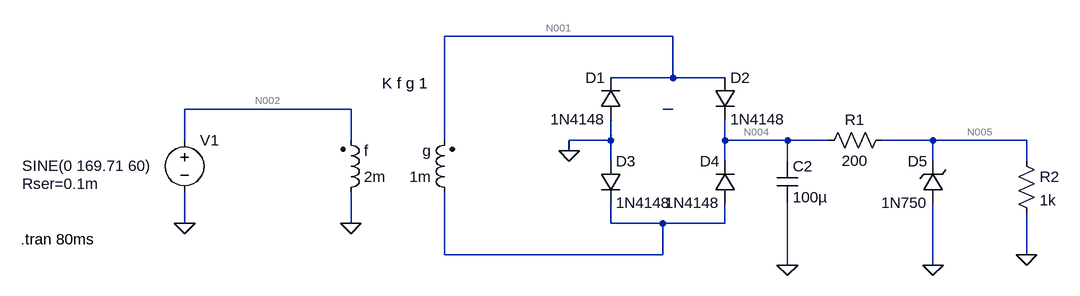
[diagram p0: schematic ACDC.asc]
ACDC.asc, the LTspice schematic file:
Version 4
SHEET 1 1400 680
WIRE 800 -64 448 -64
WIRE 800 0 800 -64
WIRE 800 0 704 0
WIRE 880 0 800 0
WIRE 304 48 48 48
WIRE 800 48 784 48
WIRE 48 96 48 48
WIRE 304 96 304 48
WIRE 448 96 448 -64
WIRE 704 96 704 64
WIRE 704 96 640 96
WIRE 880 96 880 64
WIRE 976 96 880 96
WIRE 1040 96 976 96
WIRE 1200 96 1120 96
WIRE 1344 96 1200 96
WIRE 640 112 640 96
WIRE 704 128 704 96
WIRE 880 128 880 96
WIRE 976 128 976 96
WIRE 1200 128 1200 96
WIRE 1344 128 1344 96
WIRE 48 224 48 176
WIRE 304 224 304 176
WIRE 704 224 704 192
WIRE 784 224 704 224
WIRE 880 224 880 192
WIRE 880 224 784 224
WIRE 448 272 448 176
WIRE 784 272 784 224
WIRE 784 272 448 272
WIRE 1344 272 1344 208
WIRE 976 288 976 192
WIRE 1200 288 1200 192
FLAG 304 224 0
FLAG 48 224 0
FLAG 640 112 0
FLAG 976 288 0
FLAG 1200 288 0
FLAG 1344 272 0
SYMBOL voltage 48 80 R0
WINDOW 3 -250 55 Left 2
WINDOW 123 0 0 Left 0
WINDOW 39 -250 83 Left 2
SYMATTR InstName V1
SYMATTR Value SINE(0 169.71 60)
SYMATTR SpiceLine Rser=0.1m
SYMBOL ind2 288 192 M180
WINDOW 0 36 80 Left 2
WINDOW 3 36 40 Left 2
SYMATTR InstName f
SYMATTR Value 2m
SYMATTR Type ind
SYMBOL ind2 464 192 R180
WINDOW 0 36 80 Left 2
WINDOW 3 36 40 Left 2
SYMATTR InstName g
SYMATTR Value 1m
SYMATTR Type ind
SYMBOL diode 720 64 R180
WINDOW 0 24 64 Left 2
WINDOW 3 24 0 Left 2
SYMATTR InstName D1
SYMATTR Value 1N4148
SYMBOL diode 864 0 R0
SYMATTR InstName D2
SYMATTR Value 1N4148
SYMBOL diode 688 128 R0
SYMATTR InstName D3
SYMATTR Value 1N4148
SYMBOL diode 896 192 R180
WINDOW 0 24 64 Left 2
WINDOW 3 24 0 Left 2
SYMATTR InstName D4
SYMATTR Value 1N4148
SYMBOL res 1136 80 R90
WINDOW 0 0 56 VBottom 2
WINDOW 3 32 56 VTop 2
SYMATTR InstName R1
SYMATTR Value 200
SYMBOL cap 960 128 R0
SYMATTR InstName C2
SYMATTR Value 100µ
SYMBOL zener 1216 192 R180
WINDOW 0 24 64 Left 2
WINDOW 3 24 0 Left 2
SYMATTR InstName D5
SYMATTR Value 1N750
SYMBOL res 1328 112 R0
SYMATTR InstName R2
SYMATTR Value 1k
TEXT -204 248 Left 2 !.tran 80ms
TEXT 352 8 Left 2 !K f g 1

The netlist it stands for:
* ACDC.asc
V1 N002 0 SINE(0 169.71 60) Rser=0.1m
L§f 0 N002 2m
L§g N006 N001 1m
D1 0 N001 1N4148
D2 N001 N004 1N4148
D3 0 N006 1N4148
D4 N006 N004 1N4148
R1 N005 N004 200
C2 N004 0 100µ
D5 0 N005 1N750
R2 N005 0 1k
.model D D
.lib standard.dio
.tran 80ms
K f g 1
.backanno
.end

* Results of the author's LTspice run, read from the files saved beside the schematic
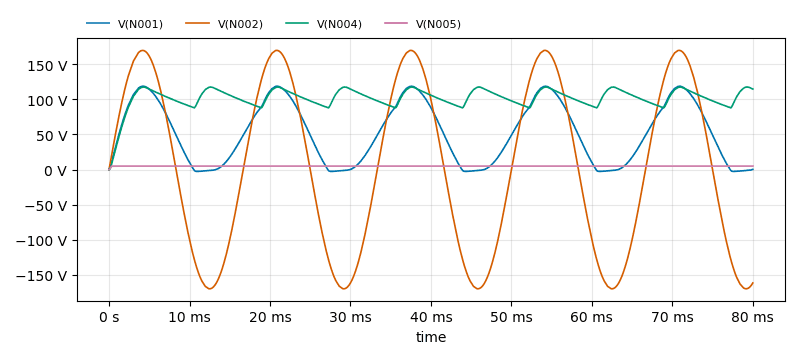
[diagram p1: Transient Analysis of ACDC.asc, plotted from the saved traces]
* Transient Analysis, 1 run:
*   V(N001): min -2.619 V, max 118.7 V, average 52.26 V, rms 67.71 V, last 221 mV
*   V(N002): min -169.7 V, max 169.7 V, average 3.84 V, rms 120.6 V, last -161.4 V
*   V(N004): min 0 V, max 117.5 V, average 101.8 V, rms 102.8 V, last 114.6 V
*   V(N005): min 0 V, max 4.985 V, average 4.947 V, rms 4.952 V, last 4.98 V